# EAGLE design PWM50 (EAGLE 5.06)
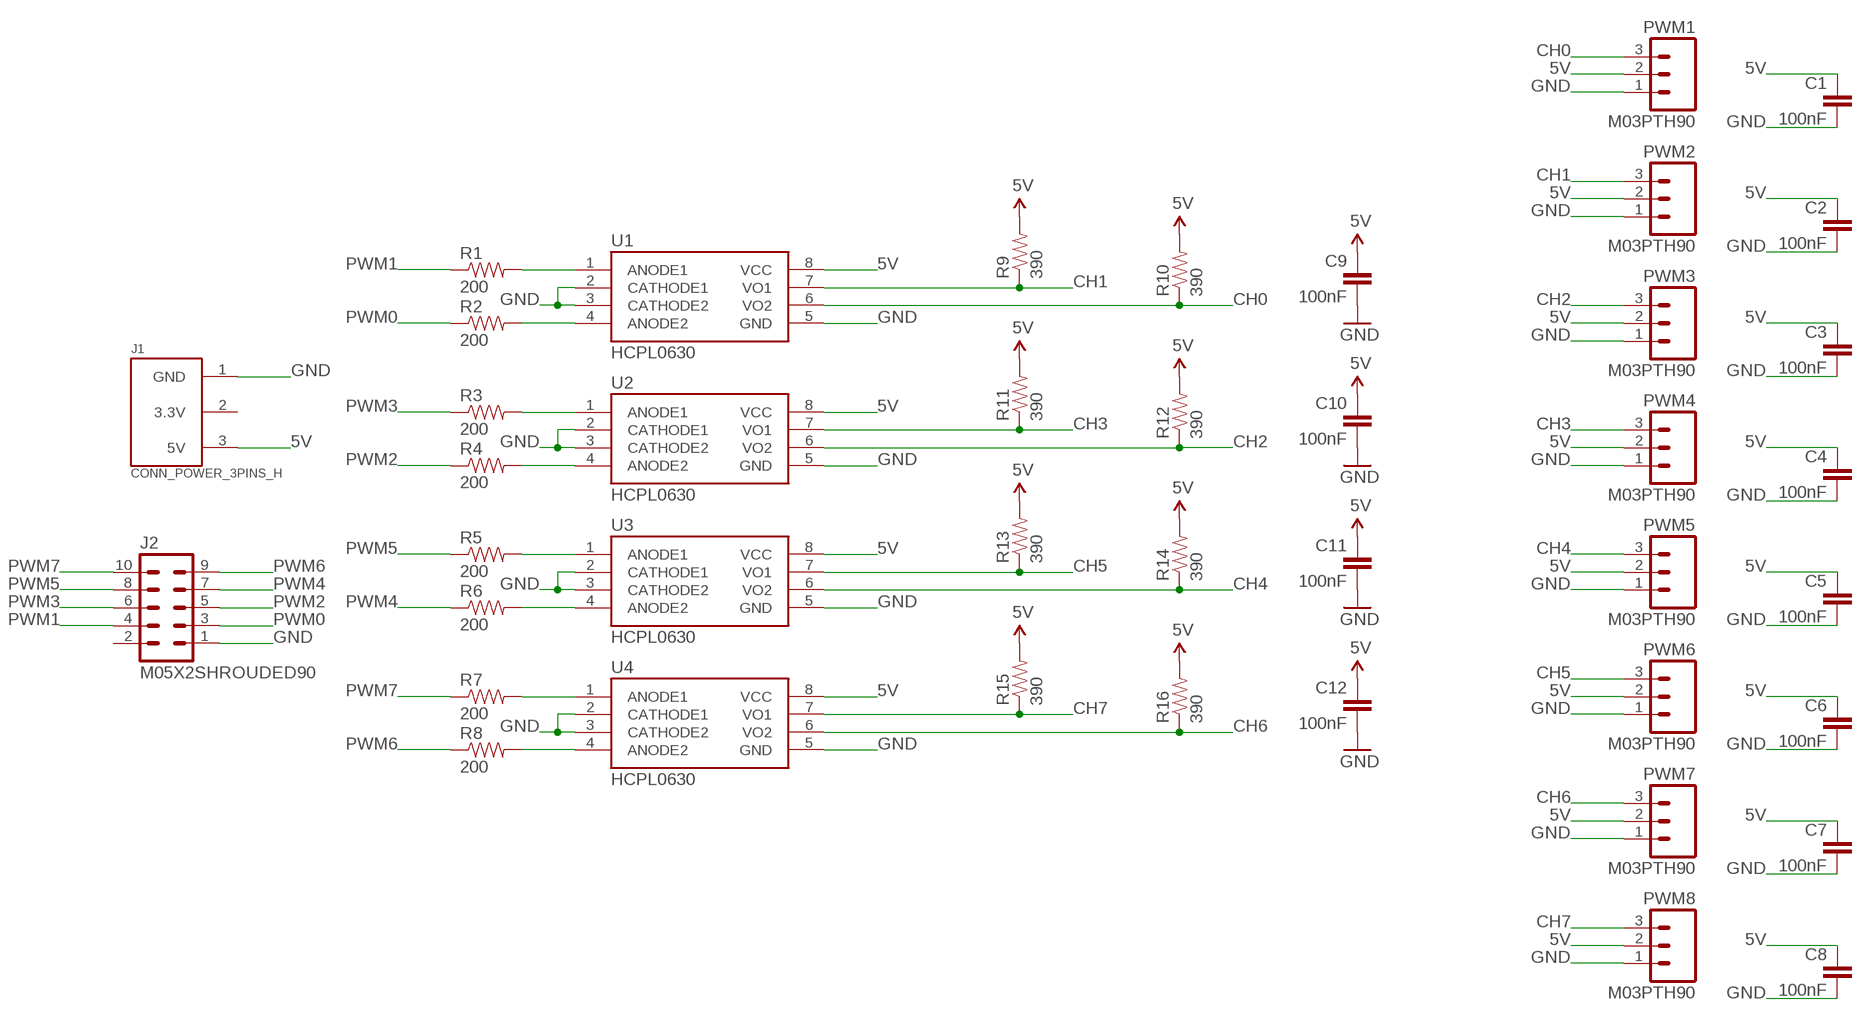
[diagram p0: schematic, sheet 1]

## Parts
C1  100nF  CAP0805  [C0805]
C2  100nF  CAP0805  [C0805]
C3  100nF  CAP0805  [C0805]
C4  100nF  CAP0805  [C0805]
C5  100nF  CAP0805  [C0805]
C6  100nF  CAP0805  [C0805]
C7  100nF  CAP0805  [C0805]
C8  100nF  CAP0805  [C0805]
C9  100nF  CAP0805  [C0805]
C10  100nF  CAP0805  [C0805]
C11  100nF  CAP0805  [C0805]
C12  100nF  CAP0805  [C0805]
J1  CONN_POWER_3PINS_H  [3PINS_3.81MM_90DEG]
J2  M05X2SHROUDED90  [2X05/90/SHROUDED]
PWM1  M03PTH90  [1X03/90]
PWM2  M03PTH90  [1X03/90]
PWM3  M03PTH90  [1X03/90]
PWM4  M03PTH90  [1X03/90]
PWM5  M03PTH90  [1X03/90]
PWM6  M03PTH90  [1X03/90]
PWM7  M03PTH90  [1X03/90]
PWM8  M03PTH90  [1X03/90]
R1  200  RESISTOR0805  [0805]
R2  200  RESISTOR0805  [0805]
R3  200  RESISTOR0805  [0805]
R4  200  RESISTOR0805  [0805]
R5  200  RESISTOR0805  [0805]
R6  200  RESISTOR0805  [0805]
R7  200  RESISTOR0805  [0805]
R8  200  RESISTOR0805  [0805]
R9  390  RESISTOR0805  [0805]
R10  390  RESISTOR0805  [0805]
R11  390  RESISTOR0805  [0805]
R12  390  RESISTOR0805  [0805]
R13  390  RESISTOR0805  [0805]
R14  390  RESISTOR0805  [0805]
R15  390  RESISTOR0805  [0805]
R16  390  RESISTOR0805  [0805]
U1  HCPL0630  [SO-8]
U2  HCPL0630  [SO-8]
U3  HCPL0630  [SO-8]
U4  HCPL0630  [SO-8]

## Nets
5V: C1.1 C2.1 C3.1 C4.1 C5.1 C6.1 C7.1 C8.1 C9.1 C10.1 C11.1 C12.1 J1.3(5V) PWM1.2 PWM2.2 PWM3.2 PWM4.2 PWM5.2 PWM6.2 PWM7.2 PWM8.2 R9.2 R10.2 R11.2 R12.2 R13.2 R14.2 R15.2 R16.2 U1.8(VCC) U2.8(VCC) U3.8(VCC) U4.8(VCC)
CH0: PWM1.3 R10.1 U1.6(VO2)
CH1: PWM2.3 R9.1 U1.7(VO1)
CH2: PWM3.3 R12.1 U2.6(VO2)
CH3: PWM4.3 R11.1 U2.7(VO1)
CH4: PWM5.3 R14.1 U3.6(VO2)
CH5: PWM6.3 R13.1 U3.7(VO1)
CH6: PWM7.3 R16.1 U4.6(VO2)
CH7: PWM8.3 R15.1 U4.7(VO1)
GND: C1.2 C2.2 C3.2 C4.2 C5.2 C6.2 C7.2 C8.2 C9.2 C10.2 C11.2 C12.2 J1.1(GND) J2.1 PWM1.1 PWM2.1 PWM3.1 PWM4.1 PWM5.1 PWM6.1 PWM7.1 PWM8.1 U1.2(CATHODE1) U1.3(CATHODE2) U1.5(GND) U2.2(CATHODE1) U2.3(CATHODE2) U2.5(GND) U3.2(CATHODE1) U3.3(CATHODE2) U3.5(GND) U4.2(CATHODE1) U4.3(CATHODE2) U4.5(GND)
N$1: R1.2 U1.1(ANODE1)
N$2: R2.2 U1.4(ANODE2)
N$3: R3.2 U2.1(ANODE1)
N$4: R4.2 U2.4(ANODE2)
N$5: R5.2 U3.1(ANODE1)
N$6: R6.2 U3.4(ANODE2)
N$7: R7.2 U4.1(ANODE1)
N$8: R8.2 U4.4(ANODE2)
PWM0: J2.3 R2.1
PWM1: J2.4 R1.1
PWM2: J2.5 R4.1
PWM3: J2.6 R3.1
PWM4: J2.7 R6.1
PWM5: J2.8 R5.1
PWM6: J2.9 R8.1
PWM7: J2.10 R7.1
Unconnected: J2.2

## Power pins joined to a net without a drawn wire
3.3V: J1.2(3.3V)

## Library data of the parts
C1-C12 = Robot:CAP: CAPACITOR
J1 = Robot:CONN_POWER_3PINS: POWER CONNECTOR for logic boards. Provides 3.3V and 5V.
J2 = Robot:M05X2: 10-PIN DUAL ROW HEADER Standard 10-pin dual row 0.1" header.
PWM1-PWM8 = Robot:M03: 3-PIN HEADER Standard 3-pin 0.1" header.
R1-R16 = Robot:RESISTOR: RESISTOR
U1-U4 = Robot:HCPL0630: HCPL-0630 High CMR, High Speed TTL Compatible Optocoupler

## Board
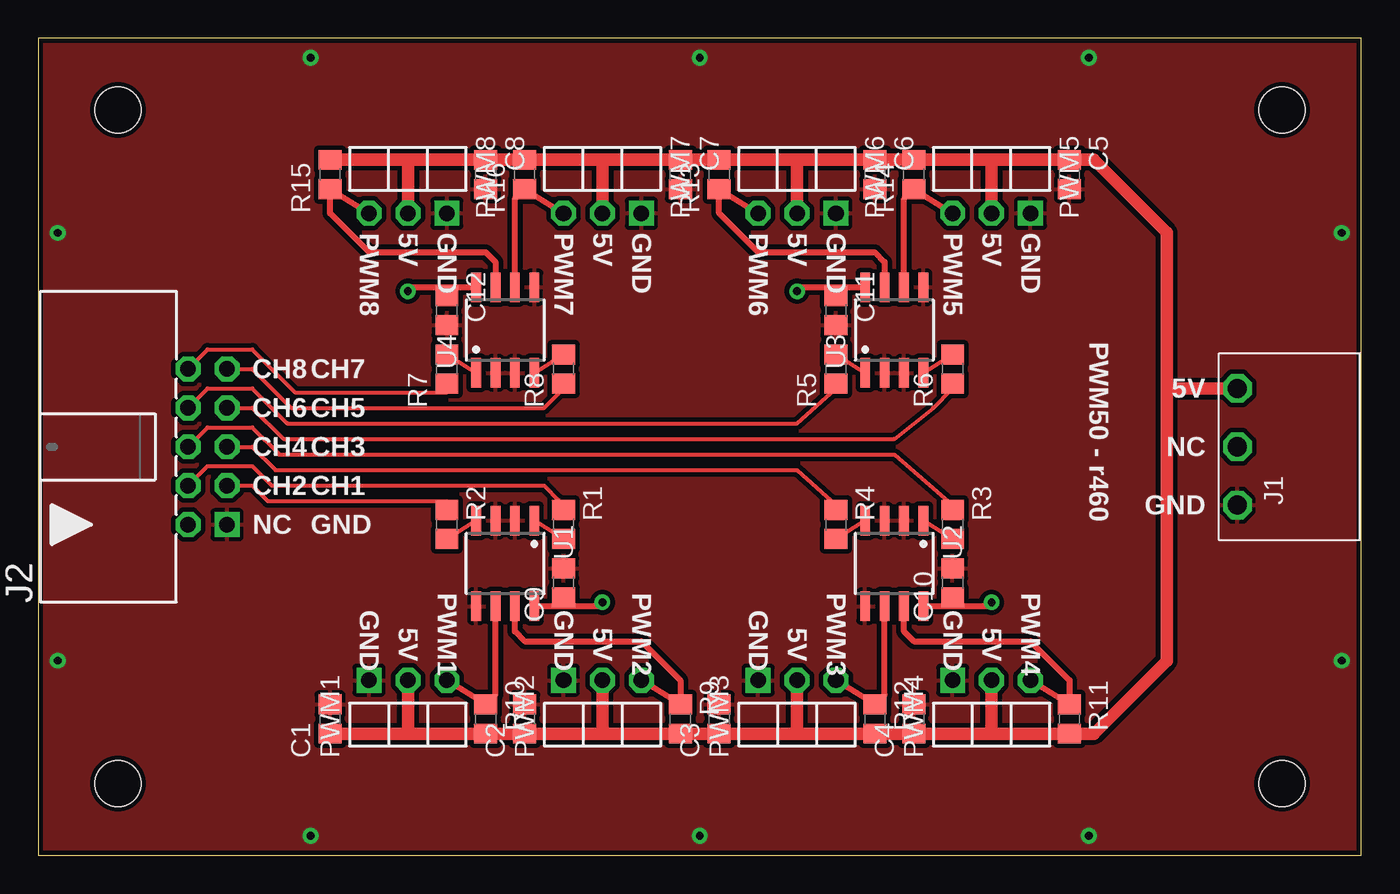
[diagram p1: board, top side]
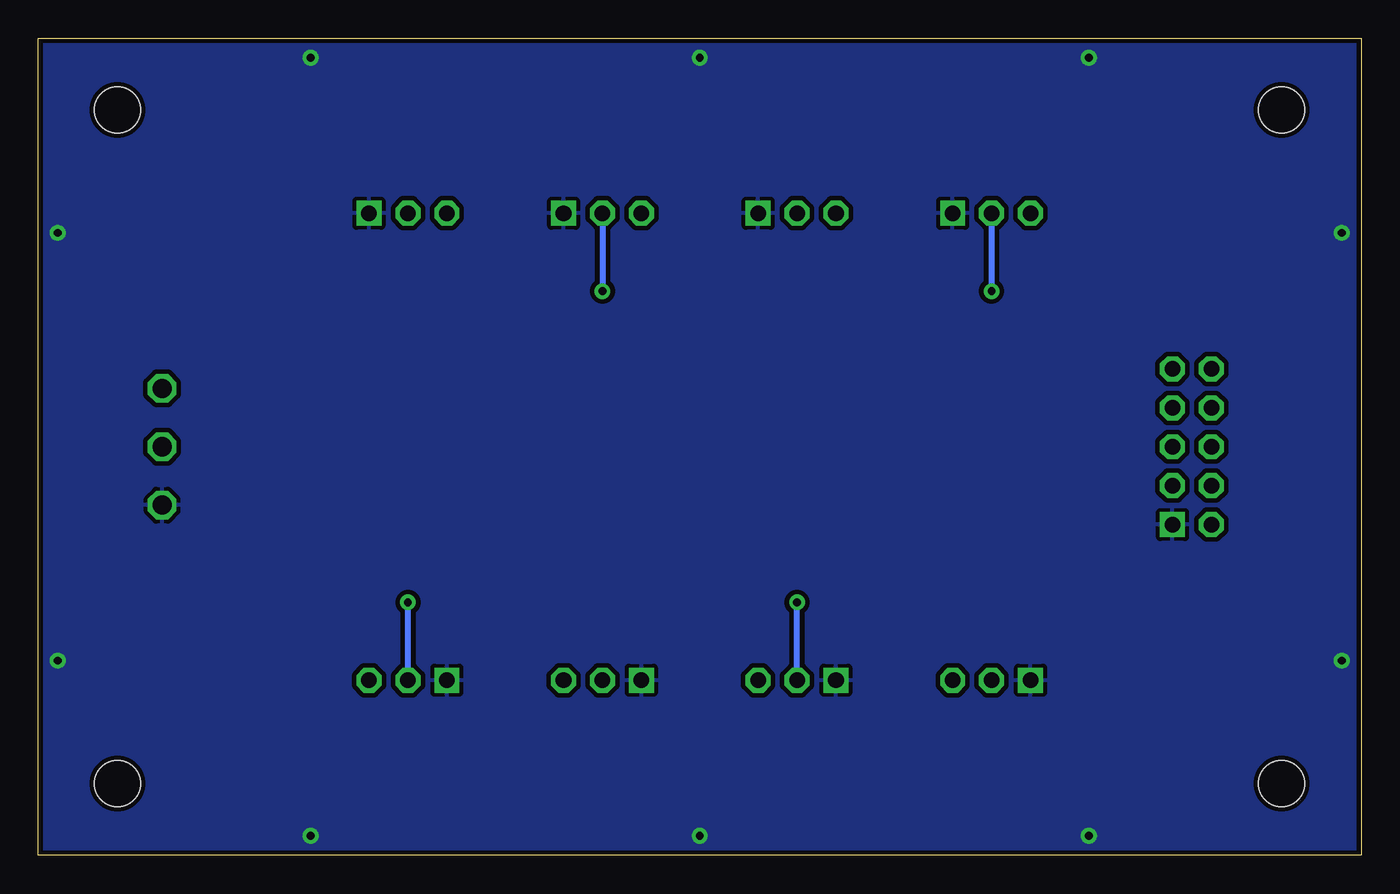
[diagram p2: board, bottom side, seen from below]

Size 86.36 x 53.34 mm. Coordinates in mm from the lower left corner, seen from the top.
Outline: 0,0 86.36,0 86.36,53.34 0,53.34 0,0
Copper layers (1*16): Top 0.035mm / dielectric 1.5mm / Bottom 0.035mm
Design rules "SparkFun": minimum track width 8mil, minimum drill 20mil, track to track 8mil, track to pad 8mil, pad to pad 8mil, via to via 8mil, smd to smd 8mil, copper to edge 10mil, drill to drill 8mil, minimum pad ring 12mil, minimum via ring 10mil, stop-mask expansion 4mil, vias tented up to drill 25mil, thermal gap 10mil
Holes 3 mm at 5.2,48.67 5.2,4.67 81.2,48.67 81.2,4.67

### Footprints (pad centres in the part's own frame; a part is rotated, then mirrored left to right if it is on the bottom)
C0805 = smd 1.3 x 1.5: 1 -0.95,0; 2 0.95,0
3PINS_3.81MM_90DEG = drill 1.25 octagon: 1 -3.81,3; 2 0,3; 3 3.81,3
2X05/90/SHROUDED = drill 1.016 square: 1 -5.08,-1.27 | drill 1.016 octagon: 2 -5.08,1.27; 3 -2.54,-1.27; 4 -2.54,1.27; 5 0,-1.27; 6 0,1.27; 7 2.54,-1.27; 8 2.54,1.27; 9 5.08,-1.27; 10 5.08,1.27
1X03/90 = drill 1.016 square: 1 -2.54,-0.01 | drill 1.016 octagon: 2 0,-0.01; 3 2.54,-0.01
0805 = smd 1.3 x 1.5: 1 -0.95,0; 2 0.95,0
SO-8 = smd 0.635 x 1.905: 1 -1.905,-2.794; 2 -0.635,-2.794; 3 0.635,-2.794; 4 1.905,-2.794; 5 1.905,2.794; 6 0.635,2.794; 7 -0.635,2.794; 8 -1.905,2.794

### Placement (x,y rotation side)
C1  19.05,8.89 90 top
C2  31.75,8.89 90 top
C3  44.45,8.89 90 top
C4  57.15,8.89 90 top
C5  67.31,44.45 270 top
C6  54.61,44.45 270 top
C7  41.91,44.45 270 top
C8  29.21,44.45 270 top
C9  34.29,17.78 90 top
C10  59.69,17.78 90 top
C11  52.07,35.56 270 top
C12  26.67,35.56 270 top
J1  81.28,26.67 90 top
J2  11.05,26.67 90 top
PWM1  24.13,11.43 0 top
PWM2  36.83,11.43 0 top
PWM3  49.53,11.43 0 top
PWM4  62.23,11.43 0 top
PWM5  62.23,41.91 180 top
PWM6  49.53,41.91 180 top
PWM7  36.83,41.91 180 top
PWM8  24.13,41.91 180 top
R1  34.29,21.59 270 top
R2  26.67,21.59 270 top
R3  59.69,21.59 270 top
R4  52.07,21.59 270 top
R5  52.07,31.75 90 top
R6  59.69,31.75 90 top
R7  26.67,31.75 90 top
R8  34.29,31.75 90 top
R9  41.91,8.89 270 top
R10  29.21,8.89 270 top
R11  67.31,8.89 270 top
R12  54.61,8.89 270 top
R13  44.45,44.45 90 top
R14  57.15,44.45 90 top
R15  19.05,44.45 90 top
R16  31.75,44.45 90 top
U1  30.48,19.05 180 top
U2  55.88,19.05 180 top
U3  55.88,34.29 0 top
U4  30.48,34.29 0 top

### Tracks (layer width: path | path; a pad name or v marks a point on that pad's centre or on a via)
5V  (via drill 0.51)
  Top 0.254: 27.24,37.08 C12.1 | 52.64,37.08 C11.1 | 59.12,16.26 C10.1 | 33.72,16.26 C9.1
  Top 0.406: U4.8 27.24,37.08 24.38,37.08 v24.13,36.83 | U3.8 52.64,37.08 49.78,37.08 v49.53,36.83 | U2.8 59.12,16.26 61.98,16.26 v62.23,16.51 | U1.8 33.72,16.26 36.58,16.26 v36.83,16.51
  Top 0.813: 73.66,30.48 J1.3 | 73.66,30.48 73.66,40.64 68.9,45.4 C5.1 62.23,45.4 | 73.66,30.48 73.66,12.7 68.9,7.94 R11.2 62.23,7.94 | 62.23,45.4 PWM5.2 | 49.53,45.4 C6.1 R14.2 62.23,45.4 | 49.53,45.4 PWM6.2 | 36.83,45.4 C7.1 R13.2 49.53,45.4 | 36.83,45.4 PWM7.2 | 24.13,45.4 C8.1 R16.2 36.83,45.4 | 24.13,45.4 PWM8.2 | 62.23,7.94 PWM4.2 | 49.53,7.94 R12.2 C4.1 62.23,7.94 | 49.53,7.94 PWM3.2 | 36.83,7.94 R9.2 C3.1 49.53,7.94 | 36.83,7.94 PWM2.2 | 24.13,7.94 R10.2 C2.1 36.83,7.94 | 24.13,7.94 PWM1.2 | 24.13,45.4 R15.2 | C1.1 24.13,7.94
  Bottom 0.406: PWM8.2 v24.13,36.83 | PWM6.2 v49.53,36.83 | PWM4.2 v62.23,16.51 | PWM2.2 v36.83,16.51
CH0
  Top 0.406: PWM1.3 R10.1 29.84,10.47 U1.6
CH1
  Top 0.406: PWM2.3 R9.1 41.91,11.43 39.37,13.97 31.75,13.97 31.11,14.61 U1.7
CH2
  Top 0.406: PWM3.3 R12.1 55.24,10.47 U2.6
CH3
  Top 0.406: PWM4.3 R11.1 67.31,11.43 64.77,13.97 57.15,13.97 56.52,14.61 U2.7
CH4
  Top 0.254: PWM5.3
  Top 0.406: PWM5.3 R14.1 56.52,42.87 U3.6
CH5
  Top 0.406: PWM6.3 R13.1 44.45,41.91 46.99,39.37 54.61,39.37 55.24,38.73 U3.7
CH6
  Top 0.406: PWM7.3 R16.1 31.11,42.87 U4.6
CH7
  Top 0.406: PWM8.3 R15.1 19.05,41.91 21.59,39.37 29.21,39.37 29.84,38.73 U4.7
GND  (via drill 0.51)
  other vias: 17.78,52.07 43.18,52.07 68.58,52.07 85.09,40.64 85.09,12.7 68.58,1.27 43.18,1.27 17.78,1.27 1.27,12.7 1.27,40.64
  pour Bottom (isolate 0.305): 0,0 0,53.34 86.36,53.34 86.36,0
  pour Top (isolate 0.305): 0,0 86.36,0 86.36,53.34 0,53.34
N$1
  Top 0.254: U1.1 R1.2
N$2
  Top 0.254: R2.2 U1.4
N$3
  Top 0.254: U2.1 R3.2
N$4
  Top 0.254: R4.2 U2.4
N$5
  Top 0.254: R5.2 U3.1
N$6
  Top 0.254: U3.4 R6.2
N$7
  Top 0.254: R7.2 U4.1
N$8
  Top 0.254: U4.4 R8.2
PWM0
  Top 0.254: R2.1 26.67,23.11 14.99,23.11 13.97,24.13 J2.3
PWM1
  Top 0.254: R1.1 33.98,22.54 33.98,23.18 33.02,24.13 15.24,24.13 13.97,25.4 11.05,25.4 J2.4
PWM2
  Top 0.254: R4.1 52.07,22.86 49.53,25.15 15.49,25.15 13.97,26.67 J2.5
PWM3
  Top 0.254: R3.1 59.69,22.86 55.88,26.16 15.75,26.16 13.97,27.94 11.05,27.94 J2.6
PWM4
  Top 0.254: R6.1 59.69,30.48 58.42,29.21 55.88,27.18 16,27.18 13.97,29.21 J2.7
PWM5
  Top 0.254: J2.8 11.05,30.48 13.97,30.48 16.26,28.19 49.53,28.19 52.07,30.48 R5.1
PWM6
  Top 0.254: J2.9 13.97,31.75 16.51,29.21 33.02,29.21 34.29,30.48 R8.1
PWM7
  Top 0.254: R7.1 26.67,30.23 16.76,30.23 13.97,33.02 11.05,33.02 J2.10

### Text on the board
tPlace: PWM8 | 5V | GND | PWM7 | 5V | GND | PWM6 | 5V | GND | PWM5 | 5V | GND | PWM50 - r460 | CH8 | CH7 | 5V | CH6 | CH5 | NC | CH4 | CH3 | CH2 | CH1 | GND | NC | GND | PWM1 | PWM2 | PWM3 | PWM4 | GND | GND | GND | GND | 5V | 5V | 5V | 5V